# EAGLE design LED (EAGLE 5.06)
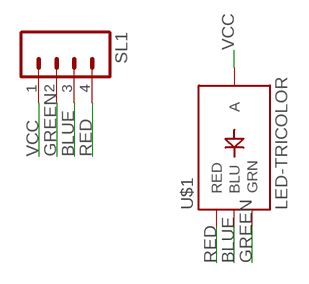
[diagram p0: schematic, sheet 1]

## Parts
SL1  M04  [04P]
U$1  LED-TRICOLOR  [LED-TRICOLOR-SMD]

## Nets
BLUE: SL1.3 U$1.B(BLU)
GREEN: SL1.2 U$1.G(GRN)
RED: SL1.4 U$1.R(RED)
VCC: SL1.1 U$1.A

## Library data of the parts
SL1 = con-amp-quick:M04: AMP QUICK CONNECTOR
U$1 = SparkFun:LED-TRICOLOR: Tri-Color LED SMD Proven layout and schematic for triple color LED in SMD package - common anode. Spark Fun Electronics SKU : COM-07844

## Board
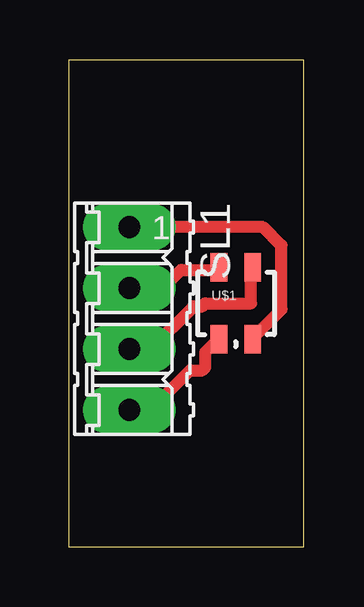
[diagram p1: board, top side]

Size 9.83 x 20.31 mm. Coordinates in mm from the lower left corner, seen from the top.
Outline: 0,0 9.83,0 9.83,20.31 0,20.31 0,0
Copper layers (1*16): Top 0.035mm / dielectric 1.5mm / Bottom 0.035mm
Design rules "default *": minimum track width 20mil, minimum drill 24mil, track to track 20mil, track to pad 20mil, pad to pad 20mil, via to via 20mil, smd to smd 20mil, copper to edge 40mil, drill to drill 8mil, minimum pad ring 20mil, minimum via ring 20mil, stop-mask expansion 4mil, vias tented up to drill 0mil, thermal gap 10mil

### Footprints (pad centres in the part's own frame; a part is rotated, then mirrored left to right if it is on the bottom)
04P = drill 0.914 long: 1 -3.81,0; 2 -1.27,0; 3 1.27,0; 4 3.81,0
LED-TRICOLOR-SMD = smd 0.7 x 1.2: A 0.7,-1.5; B 0.7,1.5; G -0.7,1.5; R -0.7,-1.5

### Placement (x,y rotation side)
SL1  2.54,9.53 270 top
U$1  6.99,10.16 0 top

### Tracks (layer width: path | path; a pad name or v marks a point on that pad's centre or on a via)
BLUE
  Top 0.508: U$1.B 7.62,11.6 7.62,10.16 5.71,10.16 5.59,10.03 5.21,10.03 3.43,8.26 SL1.3
GREEN
  Top 0.508: U$1.G 6.22,11.56 4.7,11.56 3.94,10.79 SL1.2
RED
  Top 0.508: U$1.R 6.22,8.64 5.71,8.13 5.71,7.49 5.59,7.37 5.08,7.37 3.43,5.71 SL1.4
VCC
  Top 0.508: U$1.A 7.75,8.76 8.89,9.91 8.89,12.57 8.13,13.34 SL1.1